# EAGLE design rps (EAGLE 9.4.2)
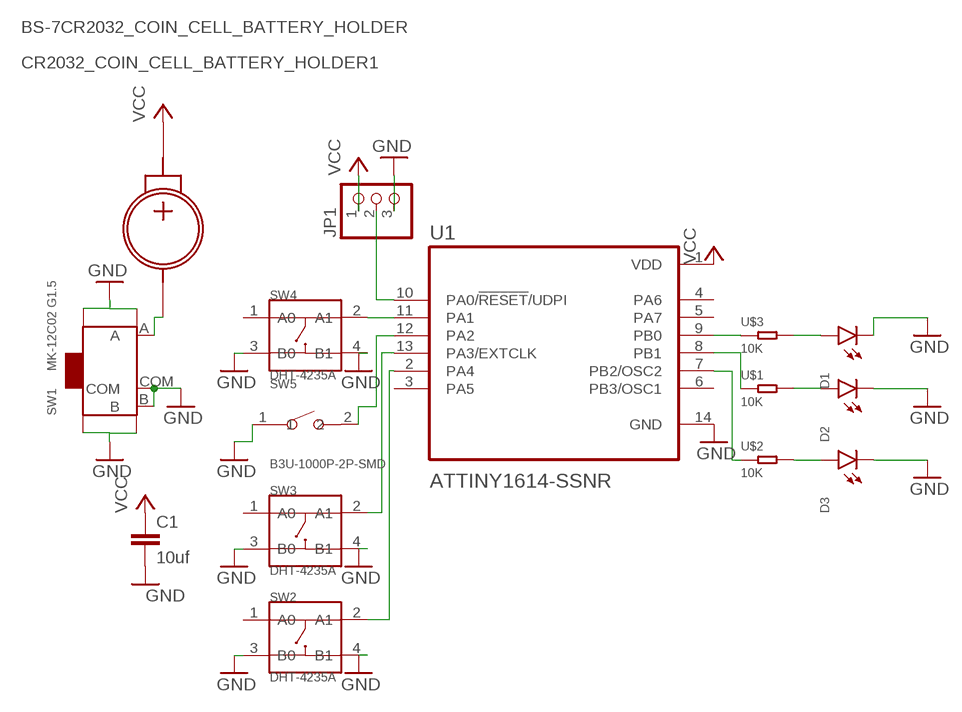
[diagram p0: schematic, sheet 1]

## Parts
C1  10uf  C-EUC0805  [C0805]
CR2032_COIN_CELL_BATTERY_HOLDER1  BS-7CR2032_COIN_CELL_BATTERY_HOLDER  [BS-7]
D1  YELLOW-0805  LEDSML0805  [SML0805]
D2  YELLOW-0805  LEDSML0805  [SML0805]
D3  YELLOW-0805  LEDSML0805  [SML0805]
JP1  PINHD-1X3  [1X03]
SW1  MK-12C02 G1.5  SMD-TOGGLE-SWITCH-ON-ON(3+4P-6.7X2.7MM)  [SW7-SMD-L6.7X2.7X3.2MM]
SW2  DHT-4235A  SMD-BUTTON-TOP-DHT-4235A(4P-4.2X3.2MM)  [SW4-SMD-4.2X3.2X2.5MM]
SW3  DHT-4235A  SMD-BUTTON-TOP-DHT-4235A(4P-4.2X3.2MM)  [SW4-SMD-4.2X3.2X2.5MM]
SW4  DHT-4235A  SMD-BUTTON-TOP-DHT-4235A(4P-4.2X3.2MM)  [SW4-SMD-4.2X3.2X2.5MM]
SW5  B3U-1000P-2P-SMD  SMD-BUTTON(2P-3.0X2.5X1.2+0.4MM)-B3U-1000P-2P-SMD  [SW2-2.6-3.0X2.5X1.2+0.4MM]
U1  ATTINY1614-SSNR  [SOIC127P600X175-14N]
U$1  10K  SMD-RES-10K-1%-1/8W(0805)  [R0805]
U$2  10K  SMD-RES-10K-1%-1/8W(0805)  [R0805]
U$3  10K  SMD-RES-10K-1%-1/8W(0805)  [R0805]

## Nets
GND: C1.2 D1.C D2.C D3.C JP1.3 SW1.B SW1.COM SW1.SS1 SW1.SS2 SW1.SS3 SW1.SS4 SW2.3(B0) SW2.4(B1) SW3.3(B0) SW3.4(B1) SW4.3(B0) SW4.4(B1) SW5.1 U1.14(GND)
N$1: JP1.2 U1.10(PA0/!RESET!/UDPI)
N$2: SW4.2(A1) U1.11(PA1)
N$3: SW5.2 U1.12(PA2)
N$4: SW3.2(A1) U1.13(PA3/EXTCLK)
N$5: SW2.2(A1) U1.2(PA4)
N$6: U1.9(PB0) U$3.1
N$7: U1.8(PB1) U$1.1
N$8: U1.7(PB2/OSC2) U$2.1
N$9: D1.A U$3.2
N$10: D2.A U$1.2
N$11: D3.A U$2.2
NEG: CR2032_COIN_CELL_BATTERY_HOLDER1.NEG SW1.A
VCC: C1.1 CR2032_COIN_CELL_BATTERY_HOLDER1.POS JP1.1 U1.1(VDD)
Unconnected: SW2.1(A0) SW3.1(A0) SW4.1(A0) U1.3(PA5) U1.4(PA6) U1.5(PA7) U1.6(PB3/OSC1)

## Library data of the parts
C1 = rcl:C-EU: CAPACITOR, European symbol; SPICEPREFIX: C
CR2032_COIN_CELL_BATTERY_HOLDER1 = CR2032_coin_cell_battery_holder:BS-7; AVAILABILITY: Unavailable; DESCRIPTION: CR2032 holder, battery rel; MF: MPD; MP: BS-7; PACKAGE: None; PRICE: None
D1-D3 = led:LED: LED OSRAM: - CHIPLED LG R971, LG N971, LY N971, LG Q971, LY Q971, LO R971, LY R971 LH N974, LH R974 LS Q976, LO Q976, LY Q976 LO Q996 - Hyper CHIPLED LW Q18S LB Q993, LB Q99A, LB R99A - SideLED LS A670, LO A670, LY A670, LG A670, LP A670 LB A673, LV A673, LT A673, LW A673 LH A674 LY A675 LS A676, LA A676, LO A676, LY A676, LW A676 LS A679, LY A679, LG A679 - Hyper Micro SIDELED® LS Y876, LA Y876, LO Y876, LY Y876 LT Y87S - SmartLED LW L88C, LW L88S LB L89C, LB L89S, LG L890 LS L89K, LO L89K, LY L89K LS L896, LA L896, LO L896, LY L896 - TOPLED LS T670, LO T670, LY T670, LG T670, LP T670 LSG T670, LSP T670, LSY T670, LOP T670, LYG T670 LG T671, LOG T671, LSG T671 LB T673, LV T673, LT T673, LW T673 LH T674 LS T676, LA T676, LO T676, LY T676, LB T676, LH T676, LSB T676, LW T676 LB T67C, LV T67C, LT T67C, LS T67K, LO T67K, LY T67K, LW E67C LS E67B, LA E67B, LO E67B, LY E67B, LB E67C, LV E67C, LT E67C LW T67C LS T679, LY T679, LG T679 LS T770, LO T770, LY T770, LG T770, LP T770 LB T773, LV T773, LT T773, LW T773 LH T774 LS E675, LA E675, LY E675, LS T675 LS T776, LA T776, LO T776, LY T776, LB T776 LHGB T686 LT T68C, LB T68C - Hyper Mini TOPLED® LB M676 - Mini TOPLED Santana® LG M470 LS M47K, LO M47K, LY M47K Source: http://www.osram.convergy.de LUXEON: - LUMILED® LXK2-PW12-R00, LXK2-PW12-S00, LXK2-PW14-U00, LXK2-PW14-V00 LXK2-PM12-R00, LXK2-PM12-S00, LXK2-PM14-U00 LXK2-PE12-Q00, LXK2-PE12-R00, LXK2-PE12-S00, LXK2-PE14-T00, LXK2-PE14-U00 LXK2-PB12-K00, LXK2-PB12-L00, LXK2-PB12-M00, LXK2-PB14-N00, LXK2-PB14-P00, LXK2-PB14-Q00 LXK2-PR12-L00, LXK2-PR12-M00, LXK2-PR14-Q00, LXK2-PR14-R00 LXK2-PD12-Q00, LXK2-PD12-R00, LXK2-PD12-S00 LXK2-PH12-R00, LXK2-PH12-S00 LXK2-PL12-P00, LXK2-PL12-Q00, LXK2-PL12-R00 Source: www.luxeon.com KINGBRIGHT: KA-3528ASYC Source: www.kingbright.com
JP1 = adafruit:PINHD-1X3: PIN HEADER
SW1 = OPL_Switch:SMD-TOGGLE-SWITCH-ON-ON(3+4P-6.7X2.7MM): 311030001; MPN: MK-12C02 G1.5
SW2-SW4 = OPL_Switch:SMD-BUTTON-TOP-DHT-4235A(4P-4.2X3.2MM): 311020045; MPN: DHT-4235A
SW5 = OPL_Switch:SMD-BUTTON(2P-3.0X2.5X1.2+0.4MM): 311020047; MPN: B3U-1000P-2P-SMD
U1 = ATTINY1614-SSNR:ATTINY1614-SSNR: 20MHz, SOIC, 85C, Green, 14 SOIC .150in T/R; AVAILABILITY: Unavailable; DESCRIPTION: 20MHz, SOIC, 85C, Green, 14 SOIC .150in T/R; MF: Microchip; MP: ATTINY1614-SSNR; PACKAGE: SO-14 Microchip; PRICE: None
U$1-U$3 = OPL_Resistor:SMD-RES-10K-1%-1/8W(0805): 301012152; MPN: RC0805FR-0710KL

## Board
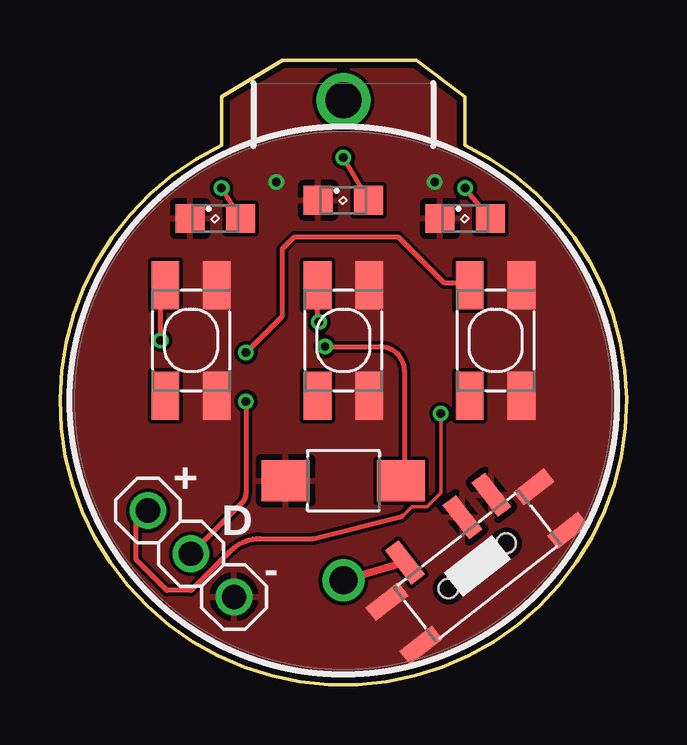
[diagram p1: board, top side]
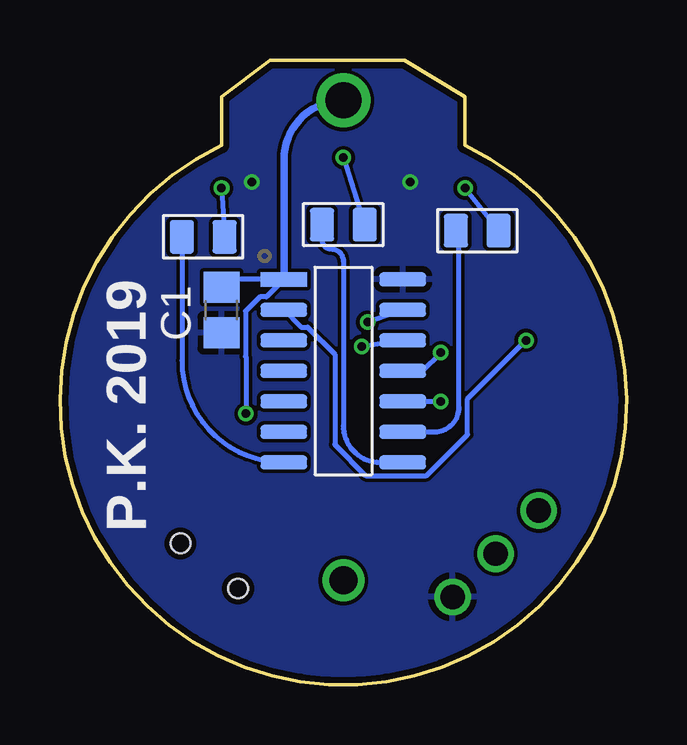
[diagram p2: board, bottom side, seen from below]

Size 23.63 x 26.02 mm. Coordinates in mm from the lower left corner, seen from the top.
Outline: 16.9,22.47 16.9,24.5 14.86,26.02 9.28,26.02 6.74,24.5 6.74,22.47 arc309 16.9,22.47
Copper layers (1*16): Top 0.035mm / dielectric 1.5mm / Bottom 0.035mm
Design rules "dirt_cheap_dirty_boards.v1.1": minimum track width 6mil, minimum drill 12mil, track to track 6mil, track to pad 6mil, pad to pad 6mil, via to via 6mil, smd to smd 0mil, copper to edge 10mil, drill to drill 10mil, minimum pad ring 10mil, minimum via ring 6mil, stop-mask expansion 2mil, vias tented up to drill 25mil, thermal gap 10mil

### Footprints (pad centres in the part's own frame; a part is rotated, then mirrored left to right if it is on the bottom)
C0805 = smd 1.3 x 1.5: 1 -0.95,0; 2 0.95,0
BS-7 = drill 1.17: NEG -10,0 | drill 1.5: POS 10,0
SML0805 = smd 1.2 x 1.2: A 1.05,0; C -1.05,0
1X03 = drill 1.016: 1 -2.54,0; 2 0,0; 3 2.54,0
SW7-SMD-L6.7X2.7X3.2MM = smd 1.8 x 0.7: A 1.978,2.286; B 1.978,-2.286; COM 1.978,-0.762 | smd 0.7 x 1.616: SS1 -1.15,-3.883; SS2 1.15,-3.883 | smd 0.7 x 1.716: SS3 1.15,3.883; SS4 -1.15,3.883 | hole 0.813: 0,-1.524; 0,1.524
SW4-SMD-4.2X3.2X2.5MM = smd 2 x 1.15: 1 -2.3,1.075; 2 2.3,1.075; 3 -2.3,-1.075; 4 2.3,-1.075
SW2-2.6-3.0X2.5X1.2+0.4MM = smd 2 x 1.7: 1 -2.4,0; 2 2.4,0
SOIC127P600X175-14N = smd 1.95 x 0.59: 1 -2.48,3.81; 2 -2.48,2.54; 3 -2.48,1.27; 4 -2.48,0; 5 -2.48,-1.27; 6 -2.48,-2.54; 7 -2.48,-3.81; 8 2.48,-3.81; 9 2.48,-2.54; 10 2.48,-1.27; 11 2.48,0; 12 2.48,1.27; 13 2.48,2.54; 14 2.48,3.81
R0805 = smd 1.397 x 1.016: 1 0,0.889; 2 0,-0.889

### Placement (x,y rotation side)
C1  16.9,15.61 270 bottom
CR2032_COIN_CELL_BATTERY_HOLDER1  11.82,14.34 90 top
D1  6.48,19.42 0 top
D2  11.82,20.18 0 top
D3  16.9,19.42 0 top
JP1  5.47,5.45 315 top
SW1  17.4,4.94 128 top
SW2  5.47,14.34 90 top
SW3  11.82,14.34 90 top
SW4  18.17,14.34 90 top
SW5  11.82,8.5 0 top
U1  11.82,13.07 0 bottom
U$1  11.82,19.17 90 bottom
U$2  17.66,18.66 90 bottom
U$3  6.23,18.91 90 bottom

### Tracks (layer width: path | path; a pad name or v marks a point on that pad's centre or on a via)
GND  (via drill 0.35)
  other vias: 9.02,20.94 15.63,20.94
  pour Bottom: -0.88,27.04 24.52,27.04 24.52,-0.9 -0.88,-0.9
  pour Top: -8.5,28.31 -8.5,-7.25 -7.23,-8.52 34.68,-8.52 38.49,-4.71 38.49,24.5 29.6,33.39 -3.42,33.39
N$1  (via drill 0.35)
  Top 0.203: v7.75,11.8 7.75,7.99 arc-45 7.57,7.56 JP1.2
  Bottom 0.203: U1.10 v7.75,11.8
N$2  (via drill 0.35)
  Top 0.203: SW4.2 17.06,16.75 16.01,16.75 14.1,18.66 9.78,18.66 9.28,18.15 9.28,15.36 v7.75,13.83
  Bottom 0.203: U1.11 8.51,13.07 v7.75,13.83
N$3  (via drill 0.35)
  Top 0.203: v11.05,14.09 13.34,14.09 arc-90 14.36,13.07 14.36,9.23 SW5.2
  Bottom 0.203: U1.12 v11.05,14.09
N$4  (via drill 0.35)
  Top 0.203: v10.8,15.1 10.74,15.1 SW3.2
  Bottom 0.203: U1.13 v10.8,15.1
N$5  (via drill 0.35)
  Top 0.203: v4.2,14.34 4.2,16.1 SW2.2
  Bottom 0.203: U1.2 13.57,14.89 13.3,14.89 12.17,13.76 12.17,10 10.89,8.71 8.34,8.71 6.63,10.42 6.63,11.9 v4.2,14.34
N$6
  Bottom 0.203: U1.9 8.01,10.53 arc-90 6.99,11.55 6.99,18.79 arc-90 U$3.1
N$7
  Bottom 0.203: U$1.1 12.7,18.53 arc-90 12.32,18.15 arc90 11.82,17.64 11.82,10.78 arc-90 10.29,9.26 U1.8
N$8
  Bottom 0.203: U1.7 arc90 18.55,13.51 U$2.1
N$9  (via drill 0.35)
  Top 0.203: v6.74,20.69 D1.A
  Bottom 0.203: v6.74,20.69 U$3.2
N$10  (via drill 0.35)
  Top 0.203: D2.A v11.82,21.96
  Bottom 0.203: v11.82,21.96 U$1.2
N$11  (via drill 0.35)
  Top 0.203: D3.A v16.9,20.69
  Bottom 0.203: v16.9,20.69 U$2.2
NEG
  Top 0.305: SW1.A CR2032_COIN_CELL_BATTERY_HOLDER1.NEG
VCC  (via drill 0.35)
  Top 0.152: 14.28,7.02 14.68,7.42 15.31,7.42 15.88,7.99 v15.88,11.29
  Top 0.203: JP1.1 3.18,6.76 3.18,5.2 4.45,3.93 5.47,3.93 7.12,5.58 arc-45 8.34,6.09 10.55,6.09 14.28,7.02
  Bottom 0.203: C1.1 arc90 16.58,16.88 U1.1 15.02,16.16 15.29,16.16 15.89,15.56 15.89,13.66 15.88,13.66 v15.88,11.29
  Bottom 0.305: U1.1 14.3,21.86 arc90 CR2032_COIN_CELL_BATTERY_HOLDER1.POS

### Text on the board
tPlace: + | D | -
bPlace: P.K. 2019